# Altium schematic sheet 06_FPGA_B.SchDoc: FPGA Part B: Bank 3-4
size 381 x 266 mm; Organization: Meteroi; Address1: Room 428, 410 Guiping Rd.; Address2: Shanghai 200233, CHINA; SheetNumber: 7; SheetTotal: 11; PageSetup: Record=PageOptions|CenterHorizontal=True|CenterVertical=True|PrintScale=0.75|XCorrection=1.00|YCorrection=1.00|PrintKind=2|BorderSize=5000000|LeftOffset=0|BottomOffset=0|Orientation=2|PaperLength=1000|PaperWidth=1000|Scale=100|PaperSource=276|PrintQuality=-3|MediaType=1|DitherType=10|PaperKind=A4|PrintScaleMode=1
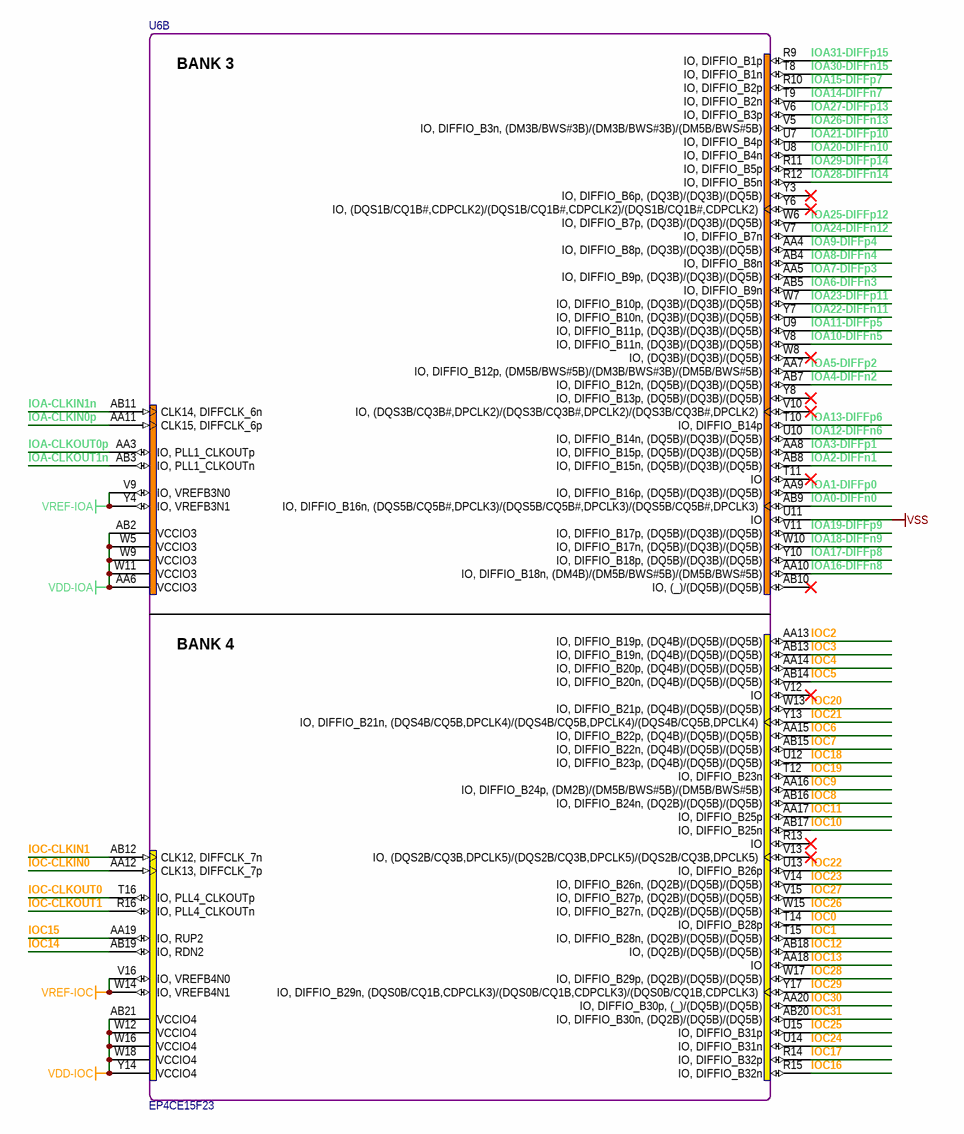
[diagram p0: 06_FPGA_B.SchDoc]

## Parts
U6  EP4CE15F23  [FBGA-484]  (part B of 5)

## Nets
VDD-IOA: U6.AA6(VCCIO3) U6.AB2(VCCIO3) U6.W5(VCCIO3) U6.W9(VCCIO3) U6.W11(VCCIO3)
VDD-IOC: U6.AB21(VCCIO4) U6.W12(VCCIO4) U6.W16(VCCIO4) U6.W18(VCCIO4) U6.Y14(VCCIO4)
VREF-IOA: U6.V9(IO,_VREFB3N0) U6.Y4(IO,_VREFB3N1)
VREF-IOC: U6.V16(IO,_VREFB4N0) U6.W14(IO,_VREFB4N1)
VSS: U6.U11(IO)
IOA0-DIFFn0: U6.AB9(IO,_DIFFIO_B16n,_(DQS5B/CQ5B#,DPCLK3)/(DQS5B/CQ5B#,DPCLK3)/(DQS5B/CQ5B#,DPCLK3))
IOA1-DIFFp0: U6.AA9(IO,_DIFFIO_B16p,_(DQ5B)/(DQ3B)/(DQ5B))
IOA2-DIFFn1: U6.AB8(IO,_DIFFIO_B15n,_(DQ5B)/(DQ3B)/(DQ5B))
IOA3-DIFFp1: U6.AA8(IO,_DIFFIO_B15p,_(DQ5B)/(DQ3B)/(DQ5B))
IOA4-DIFFn2: U6.AB7(IO,_DIFFIO_B12n,_(DQ5B)/(DQ3B)/(DQ5B))
IOA5-DIFFp2: U6.AA7(IO,_DIFFIO_B12p,_(DM5B/BWS#5B)/(DM3B/BWS#3B)/(DM5B/BWS#5B))
IOA6-DIFFn3: U6.AB5(IO,_DIFFIO_B9n)
IOA7-DIFFp3: U6.AA5(IO,_DIFFIO_B9p,_(DQ3B)/(DQ3B)/(DQ5B))
IOA8-DIFFn4: U6.AB4(IO,_DIFFIO_B8n)
IOA9-DIFFp4: U6.AA4(IO,_DIFFIO_B8p,_(DQ3B)/(DQ3B)/(DQ5B))
IOA10-DIFFn5: U6.V8(IO,_DIFFIO_B11n,_(DQ3B)/(DQ3B)/(DQ5B))
IOA11-DIFFp5: U6.U9(IO,_DIFFIO_B11p,_(DQ3B)/(DQ3B)/(DQ5B))
IOA12-DIFFn6: U6.U10(IO,_DIFFIO_B14n,_(DQ5B)/(DQ3B)/(DQ5B))
IOA13-DIFFp6: U6.T10(IO,_DIFFIO_B14p)
IOA14-DIFFn7: U6.T9(IO,_DIFFIO_B2n)
IOA15-DIFFp7: U6.R10(IO,_DIFFIO_B2p)
IOA16-DIFFn8: U6.AA10(IO,_DIFFIO_B18n,_(DM4B)/(DM5B/BWS#5B)/(DM5B/BWS#5B))
IOA17-DIFFp8: U6.Y10(IO,_DIFFIO_B18p,_(DQ5B)/(DQ3B)/(DQ5B))
IOA18-DIFFn9: U6.W10(IO,_DIFFIO_B17n,_(DQ5B)/(DQ3B)/(DQ5B))
IOA19-DIFFp9: U6.V11(IO,_DIFFIO_B17p,_(DQ5B)/(DQ3B)/(DQ5B))
IOA20-DIFFn10: U6.U8(IO,_DIFFIO_B4n)
IOA21-DIFFp10: U6.U7(IO,_DIFFIO_B4p)
IOA22-DIFFn11: U6.Y7(IO,_DIFFIO_B10n,_(DQ3B)/(DQ3B)/(DQ5B))
IOA23-DIFFp11: U6.W7(IO,_DIFFIO_B10p,_(DQ3B)/(DQ3B)/(DQ5B))
IOA24-DIFFn12: U6.V7(IO,_DIFFIO_B7n)
IOA25-DIFFp12: U6.W6(IO,_DIFFIO_B7p,_(DQ3B)/(DQ3B)/(DQ5B))
IOA26-DIFFn13: U6.V5(IO,_DIFFIO_B3n,_(DM3B/BWS#3B)/(DM3B/BWS#3B)/(DM5B/BWS#5B))
IOA27-DIFFp13: U6.V6(IO,_DIFFIO_B3p)
IOA28-DIFFn14: U6.R12(IO,_DIFFIO_B5n)
IOA29-DIFFp14: U6.R11(IO,_DIFFIO_B5p)
IOA30-DIFFn15: U6.T8(IO,_DIFFIO_B1n)
IOA31-DIFFp15: U6.R9(IO,_DIFFIO_B1p)
IOA-CLKIN0p: U6.AA11(CLK15,_DIFFCLK_6p)
IOA-CLKIN1n: U6.AB11(CLK14,_DIFFCLK_6n)
IOA-CLKOUT0p: U6.AA3(IO,_PLL1_CLKOUTp)
IOA-CLKOUT1n: U6.AB3(IO,_PLL1_CLKOUTn)
IOC0: U6.T14(IO,_DIFFIO_B28p)
IOC1: U6.T15(IO,_DIFFIO_B28n,_(DQ2B)/(DQ5B)/(DQ5B))
IOC2: U6.AA13(IO,_DIFFIO_B19p,_(DQ4B)/(DQ5B)/(DQ5B))
IOC3: U6.AB13(IO,_DIFFIO_B19n,_(DQ4B)/(DQ5B)/(DQ5B))
IOC4: U6.AA14(IO,_DIFFIO_B20p,_(DQ4B)/(DQ5B)/(DQ5B))
IOC5: U6.AB14(IO,_DIFFIO_B20n,_(DQ4B)/(DQ5B)/(DQ5B))
IOC6: U6.AA15(IO,_DIFFIO_B22p,_(DQ4B)/(DQ5B)/(DQ5B))
IOC7: U6.AB15(IO,_DIFFIO_B22n,_(DQ4B)/(DQ5B)/(DQ5B))
IOC8: U6.AB16(IO,_DIFFIO_B24n,_(DQ2B)/(DQ5B)/(DQ5B))
IOC9: U6.AA16(IO,_DIFFIO_B24p,_(DM2B)/(DM5B/BWS#5B)/(DM5B/BWS#5B))
IOC10: U6.AB17(IO,_DIFFIO_B25n)
IOC11: U6.AA17(IO,_DIFFIO_B25p)
IOC12: U6.AB18(IO,_(DQ2B)/(DQ5B)/(DQ5B))
IOC13: U6.AA18(IO)
IOC14: U6.AB19(IO,_RDN2)
IOC15: U6.AA19(IO,_RUP2)
IOC16: U6.R15(IO,_DIFFIO_B32n)
IOC17: U6.R14(IO,_DIFFIO_B32p)
IOC18: U6.U12(IO,_DIFFIO_B23p,_(DQ4B)/(DQ5B)/(DQ5B))
IOC19: U6.T12(IO,_DIFFIO_B23n)
IOC20: U6.W13(IO,_DIFFIO_B21p,_(DQ4B)/(DQ5B)/(DQ5B))
IOC21: U6.Y13(IO,_DIFFIO_B21n,_(DQS4B/CQ5B,DPCLK4)/(DQS4B/CQ5B,DPCLK4)/(DQS4B/CQ5B,DPCLK4))
IOC22: U6.U13(IO,_DIFFIO_B26p)
IOC23: U6.V14(IO,_DIFFIO_B26n,_(DQ2B)/(DQ5B)/(DQ5B))
IOC24: U6.U14(IO,_DIFFIO_B31n)
IOC25: U6.U15(IO,_DIFFIO_B31p)
IOC26: U6.W15(IO,_DIFFIO_B27n,_(DQ2B)/(DQ5B)/(DQ5B))
IOC27: U6.V15(IO,_DIFFIO_B27p,_(DQ2B)/(DQ5B)/(DQ5B))
IOC28: U6.W17(IO,_DIFFIO_B29p,_(DQ2B)/(DQ5B)/(DQ5B))
IOC29: U6.Y17(IO,_DIFFIO_B29n,_(DQS0B/CQ1B,CDPCLK3)/(DQS0B/CQ1B,CDPCLK3)/(DQS0B/CQ1B,CDPCLK3))
IOC30: U6.AA20(IO,_DIFFIO_B30p,_(_)/(DQ5B)/(DQ5B))
IOC31: U6.AB20(IO,_DIFFIO_B30n,_(DQ2B)/(DQ5B)/(DQ5B))
IOC-CLKIN0: U6.AA12(CLK13,_DIFFCLK_7p)
IOC-CLKIN1: U6.AB12(CLK12,_DIFFCLK_7n)
IOC-CLKOUT0: U6.T16(IO,_PLL4_CLKOUTp)
IOC-CLKOUT1: U6.R16(IO,_PLL4_CLKOUTn)

Not connected (* = marked no-connect by the designer): U6 AB10(IO,_(_)/(DQ5B)/(DQ5B))* R13(IO)* T11(IO)* V10(IO,_(DQS3B/CQ3B#,DPCLK2)/(DQS3B/CQ3B#,DPCLK2)/(DQS3B/CQ3B#,DPCLK2))* V12(IO)* V13(IO,_(DQS2B/CQ3B,DPCLK5)/(DQS2B/CQ3B,DPCLK5)/(DQS2B/CQ3B,DPCLK5))* W8(IO,_(DQ3B)/(DQ3B)/(DQ5B))* Y3(IO,_DIFFIO_B6p,_(DQ3B)/(DQ3B)/(DQ5B))* Y6(IO,_(DQS1B/CQ1B#,CDPCLK2)/(DQS1B/CQ1B#,CDPCLK2)/(DQS1B/CQ1B#,CDPCLK2))* Y8(IO,_DIFFIO_B13p,_(DQ5B)/(DQ3B)/(DQ5B))*

## Notes on the sheet
- Title:
- Project:
- Sheet:
- Of
- Size:
- D/N:
- Rev:
- Date:
- P/N:
- S/N:
- Designer:
- C
- (in symbol EP4CE15F23, part B) BANK 3; BANK 4

## Library data of the parts
U6 = EP4CE15F23: Cyclone IV EP4CE15F23 FPGA; PartNumber: EP4CE15F23C8N; SerialNumber: 0; Vendor: Altera; Designer: shyul; PCBMarker: FPGA; Version: 1.0; VersionDate: 2-17-2012; Value: EP4CE15F23; Publisher: Cowin